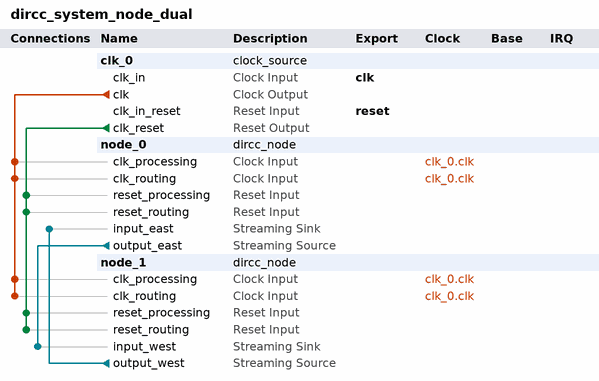
[diagram p0: system contents]
# Platform Designer (Qsys) system dircc_system_node_dual, Cyclone V 5CSEMA5F31C6
# Parameters at their usual value, and those the tool derives, are not listed.
package require -exact qsys 16.1
create_system dircc_system_node_dual
set_project_property DEVICE_FAMILY {Cyclone V}
set_project_property DEVICE 5CSEMA5F31C6

add_instance clk_0 clock_source 16.1
set_instance_parameter_value clk_0 clockFrequency 50000000

add_instance node_0 dircc_node 1.0
set_instance_parameter_value node_0 ADDRESS 0

add_instance node_1 dircc_node 1.0
set_instance_parameter_value node_1 ADDRESS 1

# connections
add_connection clk_0.clk node_0.clk_processing clock
add_connection clk_0.clk node_0.clk_routing clock
add_connection clk_0.clk node_1.clk_processing clock
add_connection clk_0.clk node_1.clk_routing clock
add_connection clk_0.clk_reset node_0.reset_processing reset
add_connection clk_0.clk_reset node_0.reset_routing reset
add_connection clk_0.clk_reset node_1.reset_processing reset
add_connection clk_0.clk_reset node_1.reset_routing reset
add_connection node_0.output_east node_1.input_west avalon_streaming
add_connection node_1.output_west node_0.input_east avalon_streaming

# exported interfaces
add_interface clk clock sink
set_interface_property clk EXPORT_OF clk_0.clk_in
add_interface reset reset sink
set_interface_property reset EXPORT_OF clk_0.clk_in_reset

set_interconnect_requirement {$system} qsys_mm.clockCrossingAdapter HANDSHAKE
set_interconnect_requirement {$system} qsys_mm.enableEccProtection FALSE
set_interconnect_requirement {$system} qsys_mm.insertDefaultSlave FALSE
set_interconnect_requirement {$system} qsys_mm.maxAdditionalLatency 1

save_system dircc_system_node_dual.qsys
